# Altium schematic sheet CAp_CDC.SchDoc
size A2; Author: Audran; CompanyName: Goldorak; Address1: Electrolab; Address2: 52 rue Paul Lescop; Address3: 92000 Nanterre; ProjectName: Cartes_2017
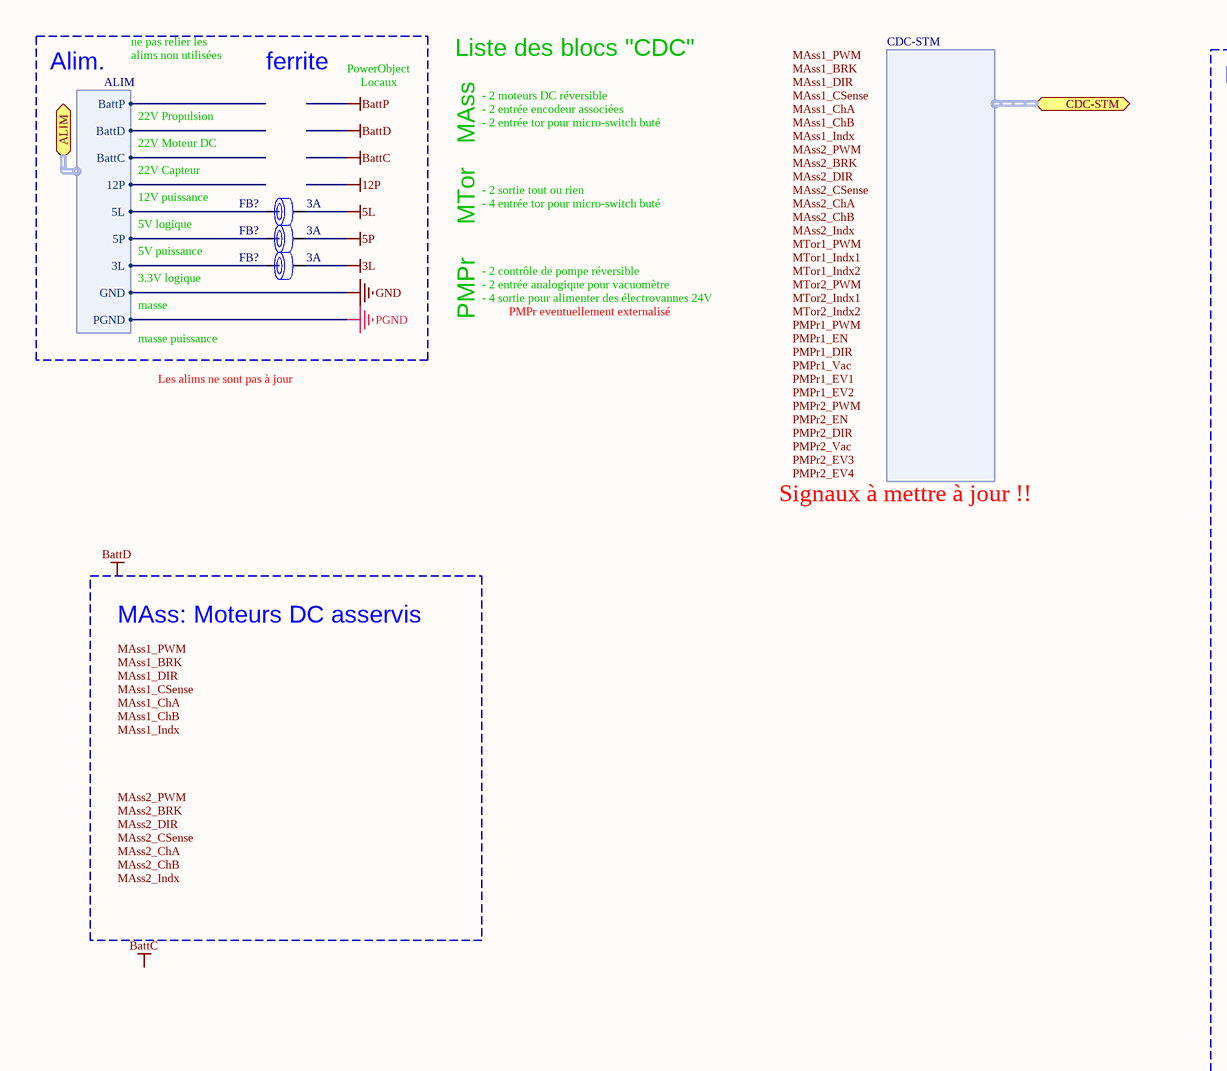
[diagram p0: CAp_CDC.SchDoc, left]
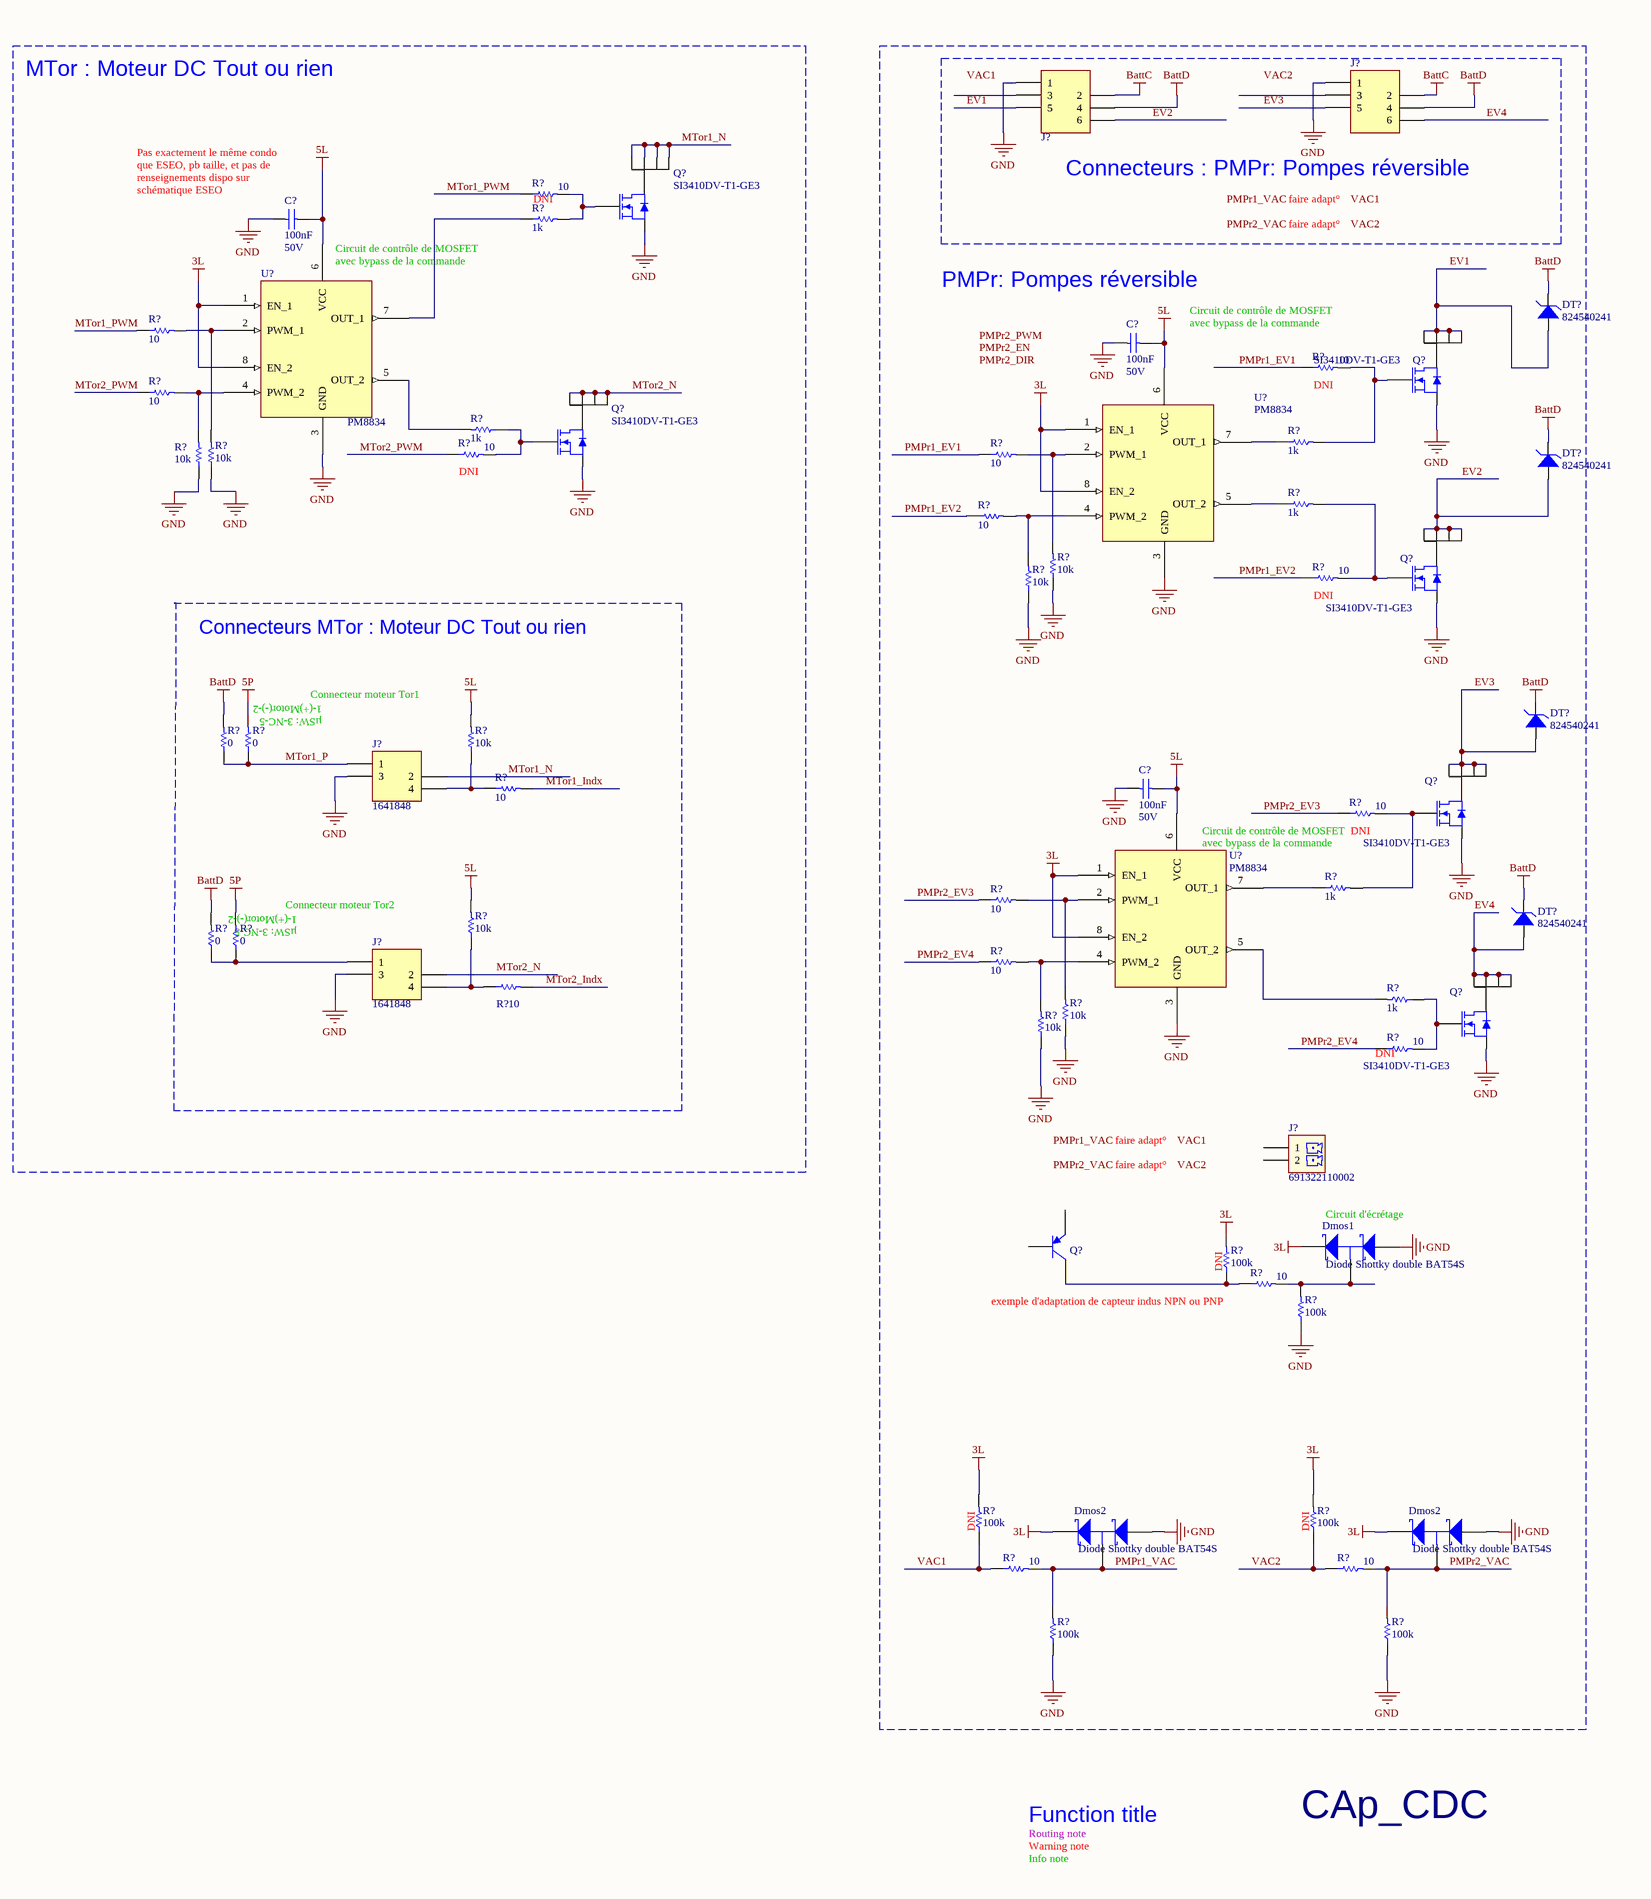
[diagram p1: CAp_CDC.SchDoc, right]

## Parts
(Parts that share a designator on the sheet are numbered #1, #2 ... from top to bottom, then left to right.)
C?#1  100nF  RatedVoltage: 50V  [WCAP-CSGP_0603, 1.6x0.8x0.8]
C?#2  100nF  RatedVoltage: 50V  [WCAP-CSGP_0603, 1.6x0.8x0.8]
C?#3  100nF  RatedVoltage: 50V  [WCAP-CSGP_0603, 1.6x0.8x0.8]
Dmos1  Diode Shottky double BAT54S  [SOT23-3N]
Dmos2#1  Diode Shottky double BAT54S  [SOT23-3N]
Dmos2#2  Diode Shottky double BAT54S  [SOT23-3N]
DT?#1  824540241  [DO-214AB_Unidirectional]
DT?#2  824540241  [DO-214AB_Unidirectional]
DT?#3  824540241  [DO-214AB_Unidirectional]
DT?#4  824540241  [DO-214AB_Unidirectional]
FB?#1  RatedCurrent: 3A  [WE-CBF_0805_High Current]  (hidden comment: 742792023)
FB?#2  RatedCurrent: 3A  [WE-CBF_0805_High Current]  (hidden comment: 742792023)
FB?#3  RatedCurrent: 3A  [WE-CBF_0805_High Current]  (hidden comment: 742792023)
J?#1  690367280676  [690367280676]  (value not drawn)
J?#2  690367280676  [690367280676]  (value not drawn)
J?#3  Supplier Part Number 1: 1641848  [690367280476]  (hidden comment: 690367280476)
J?#4  Supplier Part Number 1: 1641848  [690367280476]  (hidden comment: 690367280476)
J?#5  691322110002  [691322110002]
Q?#1  SI3410DV-T1-GE3  [TSOP95P280X110-6N]
Q?#2  SI3410DV-T1-GE3  [TSOP95P280X110-6N]
Q?#3  SI3410DV-T1-GE3  [TSOP95P280X110-6N]
Q?#4  SI3410DV-T1-GE3  [TSOP95P280X110-6N]
Q?#5  SI3410DV-T1-GE3  [TSOP95P280X110-6N]
Q?#6  SI3410DV-T1-GE3  [TSOP95P280X110-6N]
Q?#7  NSS20200LT1G  [SOT-23]  (value not drawn)
R?#1  value 10  [RESC1005X04N]  (hidden comment: RC0402FR-0710RL)
R?#2  value 1k  [RESC1608X06N]  (hidden comment: RC0603FR-071KL)
R?#3  value 10  [RESC1005X04N]  (hidden comment: RC0402FR-0710RL)
R?#4  value 10  [RESC1005X04N]  (hidden comment: RC0402FR-0710RL)
R?#5  value 10  [RESC1005X04N]  (hidden comment: RC0402FR-0710RL)
R?#6  value 1k  [RESC1608X06N]  (hidden comment: RC0603FR-071KL)
R?#7  value 1k  [RESC1005X04N]  (hidden comment: RC0402FR-071KL)
R?#8  value 10  [RESC1005X04N]  (hidden comment: RC0402FR-0710RL)
R?#9  value 10  [RESC1005X04N]  (hidden comment: RC0402FR-0710RL)
R?#10  value 10k  [RESC1005X04N]  (hidden comment: RC0402FR-0710KL)
R?#11  value 10k  [RESC1005X04N]  (hidden comment: RC0402FR-0710KL)
R?#12  value 1k  [RESC1005X04N]  (hidden comment: RC0402FR-071KL)
R?#13  value 10  [RESC1005X04N]  (hidden comment: RC0402FR-0710RL)
R?#14  value 10  [RESC1005X04N]  (hidden comment: RC0402FR-0710RL)
R?#15  value 10k  [RESC1005X04N]  (hidden comment: RC0402FR-0710KL)
R?#16  value 10k  [RESC1005X04N]  (hidden comment: RC0402FR-0710KL)
R?#17  value 0  [RESC1005X04N]  (hidden comment: RC0402JR-070RL)
R?#18  value 0  [RESC1005X04N]  (hidden comment: RC0402JR-070RL)
R?#19  value 10k  [RESC1005X04N]  (hidden comment: RC0402FR-0710KL)
R?#20  value 10  [RESC1005X04N]  (hidden comment: RC0402FR-0710RL)
R?#21  value 10  [RESC1005X04N]  (hidden comment: RC0402FR-0710RL)
R?#22  value 1k  [RESC1005X04N]  (hidden comment: RC0402FR-071KL)
R?#23  value 10  [RESC1005X04N]  (hidden comment: RC0402FR-0710RL)
R?#24  value 10k  [RESC1005X04N]  (hidden comment: RC0402FR-0710KL)
R?#25  value 0  [RESC1005X04N]  (hidden comment: RC0402JR-070RL)
R?#26  value 0  [RESC1005X04N]  (hidden comment: RC0402JR-070RL)
R?#27  value 10  [RESC1005X04N]  (hidden comment: RC0402FR-0710RL)
R?#28  value 10  [RESC1005X04N]  (hidden comment: RC0402FR-0710RL)
R?#29  value 1k  [RESC1608X06N]  (hidden comment: RC0603FR-071KL)
R?#30  value 10k  [RESC1005X04N]  (hidden comment: RC0402FR-0710KL)
R?#31  value 10k  [RESC1005X04N]  (hidden comment: RC0402FR-0710KL)
R?#32  value 10  [RESC1005X04N]  (hidden comment: RC0402FR-0710RL)
R?#33  value 100k  [RESC1608X06N]  (hidden comment: RC0603FR-07100KL)
R?#34  value 10  [RESC1005X04N]  (hidden comment: RC0402FR-0710RL)
R?#35  value 100k  [RESC1608X06N]  (hidden comment: RC0603FR-07100KL)
R?#36  value 100k  [RESC1608X06N]  (hidden comment: RC0603FR-07100KL)
R?#37  value 100k  [RESC1608X06N]  (hidden comment: RC0603FR-07100KL)
R?#38  value 10  [RESC1005X04N]  (hidden comment: RC0402FR-0710RL)
R?#39  value 10  [RESC1005X04N]  (hidden comment: RC0402FR-0710RL)
R?#40  value 100k  [RESC1608X06N]  (hidden comment: RC0603FR-07100KL)
R?#41  value 100k  [RESC1608X06N]  (hidden comment: RC0603FR-07100KL)
U?#1  PM8834  [SOIC127P600X175-8N]
U?#2  PM8834  [SOIC127P600X175-8N]
U?#3  PM8834  [SOIC127P600X175-8N]

## Blocks framed on the sheet
PMPr: Pompes réversible: C?#2 C?#3 Dmos1 Dmos2#1 Dmos2#2 DT?#1-DT?#4 J?#5 Q?#2 Q?#4-Q?#7 R?#4 R?#7 R?#9 R?#12-R?#16 R?#21-R?#23 R?#27 R?#29-R?#41 U?#2 U?#3
Connecteurs : PMPr: Pompes réversible: J?#1 J?#2
Connecteurs MTor : Moteur DC Tout ou rien: J?#3 J?#4 R?#17-R?#20 R?#24-R?#26 R?#28

## Ports
ALIM (harness ALIM), CDC-STM (harness CDC-STM)

## Harnesses
CDC-STM: 
ALIM: BattP, BattD, BattC, 12P, 5L, 5P, 3L, GND, PGND

## Nets
3L: Dmos1.2(K) Dmos2#1.2(K) Dmos2#2.2(K) FB?#3.2 R?#33.2 R?#36.2 R?#37.2 U?#1.1(EN_1) U?#1.8(EN_2) U?#2.1(EN_1) U?#2.8(EN_2) U?#3.1(EN_1) U?#3.8(EN_2)
5L: C?#1.2 C?#2.2 C?#3.2 FB?#1.2 R?#19.2 R?#24.2 U?#1.6(VCC) U?#2.6(VCC) U?#3.6(VCC)
5P: FB?#2.2 R?#18.2 R?#26.2
BattC: J?#1.2 J?#2.2
BattD: DT?#1.2 DT?#2.2 DT?#3.2 DT?#4.2 J?#1.4 J?#2.4 R?#17.2 R?#25.2
GND: C?#1.1 C?#2.1 C?#3.1 Dmos1.1(A) Dmos2#1.1(A) Dmos2#2.1(A) J?#1.1 J?#2.1 J?#3.3 J?#4.3 Q?#1.4(S) Q?#2.4(S) Q?#3.4(S) Q?#4.4(S) Q?#5.4(S) Q?#6.4(S) R?#10.1 R?#11.1 R?#15.1 R?#16.1 R?#30.1 R?#31.1 R?#35.1 R?#40.1 R?#41.1 U?#1.3(GND) U?#2.3(GND) U?#3.3(GND) ; port ALIM.GND
PGND: port ALIM.PGND
EV1: DT?#1.1 J?#1.5 Q?#2.1(D) Q?#2.2(D) Q?#2.5(D) Q?#2.6(D)
EV2: DT?#2.1 J?#1.6 Q?#4.1(D) Q?#4.2(D) Q?#4.5(D) Q?#4.6(D)
EV3: DT?#3.1 J?#2.5 Q?#5.1(D) Q?#5.2(D) Q?#5.5(D) Q?#5.6(D)
EV4: DT?#4.1 J?#2.6 Q?#6.1(D) Q?#6.2(D) Q?#6.5(D) Q?#6.6(D)
MTor1_Indx: R?#20.2
MTor1_N: J?#3.2 Q?#1.1(D) Q?#1.2(D) Q?#1.5(D) Q?#1.6(D)
MTor1_P: J?#3.1 R?#17.1 R?#18.1
MTor1_PWM: R?#1.1 R?#3.1
MTor2_Indx: R?#28.2
MTor2_N: J?#4.2 Q?#3.1(D) Q?#3.2(D) Q?#3.5(D) Q?#3.6(D)
MTor2_PWM: R?#5.1 R?#8.1
PMPr1_EV1: R?#4.1 R?#9.1
PMPr1_EV2: R?#13.1 R?#14.1
PMPr1_VAC: Dmos2#1.3(C) R?#38.2 R?#40.2
PMPr2_EV3: R?#21.1 R?#23.1
PMPr2_EV4: R?#27.1 R?#32.1
PMPr2_VAC: Dmos2#2.3(C) R?#39.2 R?#41.2
VAC1: R?#36.1 R?#38.1
VAC2: R?#37.1 R?#39.1
NetDmos1_3: Dmos1.3(C) R?#34.2 R?#35.2
NetFB?#1_1: FB?#1.1 ; port ALIM.5L
NetFB?#2_1: FB?#2.1 ; port ALIM.5P
NetFB?#3_1: FB?#3.1 ; port ALIM.3L
NetJ?#3_4: J?#3.4 R?#19.1 R?#20.1
NetJ?#4_1: J?#4.1 R?#25.1 R?#26.1
NetJ?#4_4: J?#4.4 R?#24.1 R?#28.1
NetQ?#1_3: Q?#1.3(G) R?#1.2 R?#2.2
NetQ?#2_3: Q?#2.3(G) R?#4.2 R?#7.2
NetQ?#3_3: Q?#3.3(G) R?#6.1 R?#8.2
NetQ?#4_3: Q?#4.3(G) R?#12.2 R?#14.2
NetQ?#5_3: Q?#5.3(G) R?#21.2 R?#22.2
NetQ?#6_3: Q?#6.3(G) R?#29.1 R?#32.2
NetQ?#7_3: Q?#7.3(C) R?#33.1 R?#34.1
NetR?#2_1: R?#2.1 U?#1.7(OUT_1)
NetR?#3_2: R?#3.2 R?#11.2 U?#1.2(PWM_1)
NetR?#5_2: R?#5.2 R?#10.2 U?#1.4(PWM_2)
NetR?#6_2: R?#6.2 U?#1.5(OUT_2)
NetR?#7_1: R?#7.1 U?#2.7(OUT_1)
NetR?#9_2: R?#9.2 R?#15.2 U?#2.2(PWM_1)
NetR?#12_1: R?#12.1 U?#2.5(OUT_2)
NetR?#13_2: R?#13.2 R?#16.2 U?#2.4(PWM_2)
NetR?#22_1: R?#22.1 U?#3.7(OUT_1)
NetR?#23_2: R?#23.2 R?#30.2 U?#3.2(PWM_1)
NetR?#27_2: R?#27.2 R?#31.2 U?#3.4(PWM_2)
NetR?#29_2: R?#29.2 U?#3.5(OUT_2)

Not connected (* = marked no-connect by the designer): J?#1 3; J?#2 3; J?#5 1 2; Q?#7 1(B) 2(E)

## Notes on the sheet
- Alim.
- ne pas relier les
- alims non utilisées
- ferrite
- PowerObject
- Locaux
- Liste des blocs "CDC"
- - 2 moteurs DC réversible
- MTor : Moteur DC Tout ou rien
- 22V Propulsion
- 22V Moteur DC
- - 2 entrée encodeur associées
- - 2 entrée tor pour micro-switch buté
- MAss
- 5V logique
- 12V puissance
- 22V Capteur
- - 2 sortie tout ou rien
- - 4 entrée tor pour micro-switch buté
- MTor
- (near C?#1) Pas exactement le même condo que ESEO, pb taille, et pas de renseignements dispo sur schématique ESEO
- (near R?#1) DNI
- faire adapt°
- 5V puissance
- 3.3V logique
- - 2 contrôle de pompe réversible
- - 2 entrée analogique pour vacuomètre
- - 4 sortie pour alimenter des électrovannes 24V
- (near U?#1) Circuit de contrôle de MOSFET
- (near U?#1) avec bypass de la commande
- masse
- masse puissance
- PMPr
- PMPr eventuellement externalisé
- Circuit de contrôle de MOSFET
- avec bypass de la commande
- Les alims ne sont pas à jour
- (near R?#4) DNI
- Signaux à mettre à jour !!
- (near R?#8) DNI
- MAss: Moteurs DC asservis
- (near R?#14) DNI
- Connecteur moteur Tor1
- 1-(+)Motor(-)-2
- (near J?#3) µSW: 3-NC-5
- (near R?#21) DNI
- (near U?#3) avec bypass de la commande
- Connecteur moteur Tor2
- (near J?#4) 1-(+)Motor(-)-2
- (near J?#4) µSW: 3-NC-5
- (near R?#32) DNI
- (near R?#33) DNI
- (near Dmos1) Circuit d'écrétage
- (near R?#34) exemple d'adaptation de capteur indus NPN ou PNP
- (near R?#36) DNI
- (near R?#37) DNI
- Function title
- CAp_CDC
- Routing note
- Warning note
- Info note
- Labels drawn without touching a wire or pin: BattC, BattD, MAss1_BRK, MAss1_ChA, MAss1_ChB, MAss1_CSense, MAss1_DIR, MAss1_Indx, MAss1_PWM, MAss2_BRK, MAss2_ChA, MAss2_ChB, MAss2_CSense, MAss2_DIR, MAss2_Indx, MAss2_PWM, MTor1_Indx1, MTor1_Indx2, MTor1_PWM, MTor2_Indx1, MTor2_Indx2, MTor2_PWM, PMPr1_DIR, PMPr1_EN, PMPr1_EV1, PMPr1_EV2, PMPr1_PWM, PMPr1_VAC, PMPr1_Vac, PMPr2_DIR, PMPr2_EN, PMPr2_EV3, PMPr2_EV4, PMPr2_PWM, PMPr2_Vac, PMPr2_VAC, VAC1, VAC2

## Library data of the parts
C?#1-C?#3 = WCAP-CSGP, 885012206095: CAP CER 100nF 50V X7R 0603; Manufacturer: Wurth Elektronik; PublishedDate: Aug 2016; ComponentLink1Description: Manufacturer; ComponentLink1URL: http://www.we-online.de; ComponentLink2Description: Datasheet; ComponentLink2URL: http://katalog.we-online.com/pbs/datasheet/885012206095.pdf; Manufacturer Part Number: 885012206095; Value: 100nF; Size: 0603; CeramicType: X7R
Dmos1 Dmos2#1 Dmos2#2 = Diode Shottky double BAT54S: DIODE SCHOTTKY DOUBLE; Manufacturer: ZETEX; ComponentLink1URL: http://www.farnell.com/datasheets/27632.pdf; ComponentLink1Description: http://www.farnell.com/datasheets/27632.pdf; Supplier: Farnell; RoHS: YES; Supplier Part Number: 9526510; Pricing: 5=0,32, 25=0,26, 100=0,21, 1000=0,17 (EUR); Manufacturer Part Number: BAT54S
DT?#1-DT?#4 = 824540241: WE-TVSP Power TVS Diode, Unidirectional, 1500 W, 24 VDC; Manufacturer: Wurth Electronics Inc.; Supplier 1: Farnell; Supplier Part Number 1: 2536699; Manufacturer Part Number: 824540241; ComponentLink1URL: http://katalog.we-online.de/pbs/datasheet/824540241.pdf; ComponentLink1Description: Datasheet
FB?#1-FB?#3 = WE-CBF, 742792023: Ferrite Bead 120ohm 0805 max3.0A; Manufacturer: Wurth Elektronik; Value: 120Ω; Type: High Current; PublishedDate: Aug 2016; ComponentLink1Description: Manufacturer; ComponentLink1URL: http://www.we-online.de; ComponentLink2Description: Datasheet; ComponentLink2URL: http://katalog.we-online.de/pbs/datasheet/742792023.pdf; Manufacturer Part Number: 742792023; Size: 0805
J?#1 J?#2 = 690367280676: WR-MM 6p Female SMT Connector with Polarization; Manufacturer: Wurth Electronics Inc.; Value: 6; ComponentLink1URL: http://www.we-online.com; ComponentLink1Description: Manufacturer; ComponentLink2URL: http://katalog.we-online.de/em/datasheet/69036728xx76.pdf; ComponentLink2Description: Datasheet; Manufacturer Part Number: 690367280676; Supplier 1: Farnell; Supplier Part Number 1: 1641849
J?#3 J?#4 = 690367280476: WR-MM 4p Female SMT Connector with Polarization; Manufacturer: Wurth Electronics Inc.; Value: 4; ComponentLink1URL: http://www.we-online.com; ComponentLink1Description: Manufacturer; ComponentLink2URL: http://katalog.we-online.de/em/datasheet/69036728xx76.pdf; ComponentLink2Description: Datasheet; Manufacturer Part Number: 690367280476; Supplier 1: Farnell
J?#5 = 691322110002: TERM BLOCK HDR 2POS 90DEG 3.5MM; Manufacturer: Wurth Electronics Inc.; Value: 2; Supplier 1: Farnell; Manufacturer Part Number: 691322110002; ComponentLink1URL: http://www.we-online.com; Supplier Part Number 1: 1841315; ComponentLink1Description: Manufacturer; ComponentLink2Description: Datasheet; ComponentLink2URL: http://katalog.we-online.de/em/datasheet/6913221100xx.pdf
Q?#1-Q?#6 = SI3410DV-T1-GE3: MOSFET N-CH 30V 8A 6-TSOP; Manufacturer: Vishay Siliconix; Supplier 1: Farnell; Supplier Part Number 1: 2454803; Manufacturer Part Number: SI3410DV-T1-GE3; ComponentLink1URL: http://www.vishay.com/docs/69254/si3410dv.pdf; ComponentLink1Description: Datasheet
Q?#7 = NSS20200LT1G: NSS20200LT1G PNP; Manufacturer 1: ON SEMICONDUCTOR; ComponentLink1Description: http://www.onsemi.com/pub_link/Collateral/NSS20200L-D.PDF; ComponentLink1URL: http://www.onsemi.com/pub_link/Collateral/NSS20200L-D.PDF; Supplier 1: Farnell; Supplier Part Number 1: 1887110; Manufacturer Part Number: NSS20200LT1G
R?#1 R?#3-R?#5 R?#8 R?#9 R?#13 R?#14 R?#20 R?#21 R?#23 R?#27 R?#28 R?#32 R?#34 R?#38 R?#39 = RC0402FR-0710RL: RES SMD 10 OHM 1% 1/16W 0402; Manufacturer: Yageo; Power: 63mW; Vmax: 50V; Type: Thick Film; ComponentLink1Description: Manufacturer; ComponentLink1URL: http://www.yageo.com/NewPortal/_en/index.jsp; ComponentLink2Description: Datasheet; ComponentLink2URL: http://www.farnell.com/datasheets/1018594.pdf; Manufacturer Part Number: RC0402FR-0710RL; Supplier 1: Farnell; Supplier Part Number 1: 9238999; Precision: ±1%
R?#2 R?#6 R?#29 = RC0603FR-071KL: RES SMD 1K OHM 1% 1/10W 0603; Manufacturer: Yageo; Power: 100mW; Vmax: 50V; Manufacturer Part Number: RC0603FR-071KL; Type: Thick Film; ComponentLink1Description: Manufacturer; ComponentLink1URL: http://www.yageo.com/NewPortal/_en/index.jsp; ComponentLink2Description: Datasheet; ComponentLink2URL: http://www.farnell.com/datasheets/2167052.pdf; Precision: ±1%; Supplier 1: Farnell; Supplier Part Number 1: 9238484
R?#7 R?#12 R?#22 = RC0402FR-071KL: RES SMD 1K OHM 1% 1/16W 0402; Manufacturer: Yageo; Power: 63mW; Vmax: 50V; Type: Thick Film; ComponentLink1Description: Manufacturer; ComponentLink1URL: http://www.yageo.com/NewPortal/_en/index.jsp; ComponentLink2Description: Datasheet; ComponentLink2URL: http://www.farnell.com/datasheets/2167052.pdf; Manufacturer Part Number: RC0402FR-071KL; Supplier 1: Farnell; Supplier Part Number 1: 9239235; Precision: ±1%
R?#10 R?#11 R?#15 R?#16 R?#19 R?#24 R?#30 R?#31 = RC0402FR-0710KL: RES SMD 10K OHM 1% 1/16W 0402; Manufacturer: Yageo; Power: 63mW; Vmax: 50V; Type: Thick Film; ComponentLink1Description: Manufacturer; ComponentLink1URL: http://www.yageo.com/NewPortal/_en/index.jsp; ComponentLink2Description: Datasheet; ComponentLink2URL: http://www.farnell.com/datasheets/2167052.pdf; Supplier 1: Farnell; Supplier Part Number 1: 9239359; Manufacturer Part Number: RC0402FR-0710KL; Precision: ±1%
R?#17 R?#18 R?#25 R?#26 = RC0402JR-070RL: RES SMD 0 OHM 5% 1/16W 0402; Manufacturer: Yageo; Power: 63mW; Vmax: 50V; Type: Thick Film; ComponentLink1Description: Manufacturer; ComponentLink1URL: http://www.yageo.com/NewPortal/_en/index.jsp; ComponentLink2Description: Datasheet; ComponentLink2URL: http://www.farnell.com/datasheets/1018594.pdf; Manufacturer Part Number: RC0402JR-070RL; Supplier 1: Farnell; Supplier Part Number 1: 9232516; Precision: ±5%
R?#33 R?#35-R?#37 R?#40 R?#41 = RC0603FR-07100KL: RES SMD 100K OHM 1% 1/10W 0603; Manufacturer: Yageo; Power: 100mW; Vmax: 50V; Manufacturer Part Number: RC0603FR-07100KL; Type: Thick Film; ComponentLink1Description: Manufacturer; ComponentLink1URL: http://www.yageo.com/NewPortal/_en/index.jsp; ComponentLink2Description: Datasheet; ComponentLink2URL: http://www.farnell.com/datasheets/2167052.pdf; Supplier 1: Farnell; Supplier Part Number 1: 2309107; Precision: ±1%
U?#1-U?#3 = PM8834: IC MOSFET DVR 4A DUAL 8SOIC; Manufacturer: STMicroelectronics; ComponentLink1URL: http://www.st.com/content/ccc/resource/technical/document/datasheet/9a/22/3e/55/d3/f8/46/d5/CD00212712.pdf/files/CD00212712.pdf/jcr:content/translations/en.CD00212712.pdf; ComponentLink1Description: Datasheet; Manufacturer Part Number: PM8834; Supplier 1: Digi-Key; Supplier Part Number 1: PM8834-ND